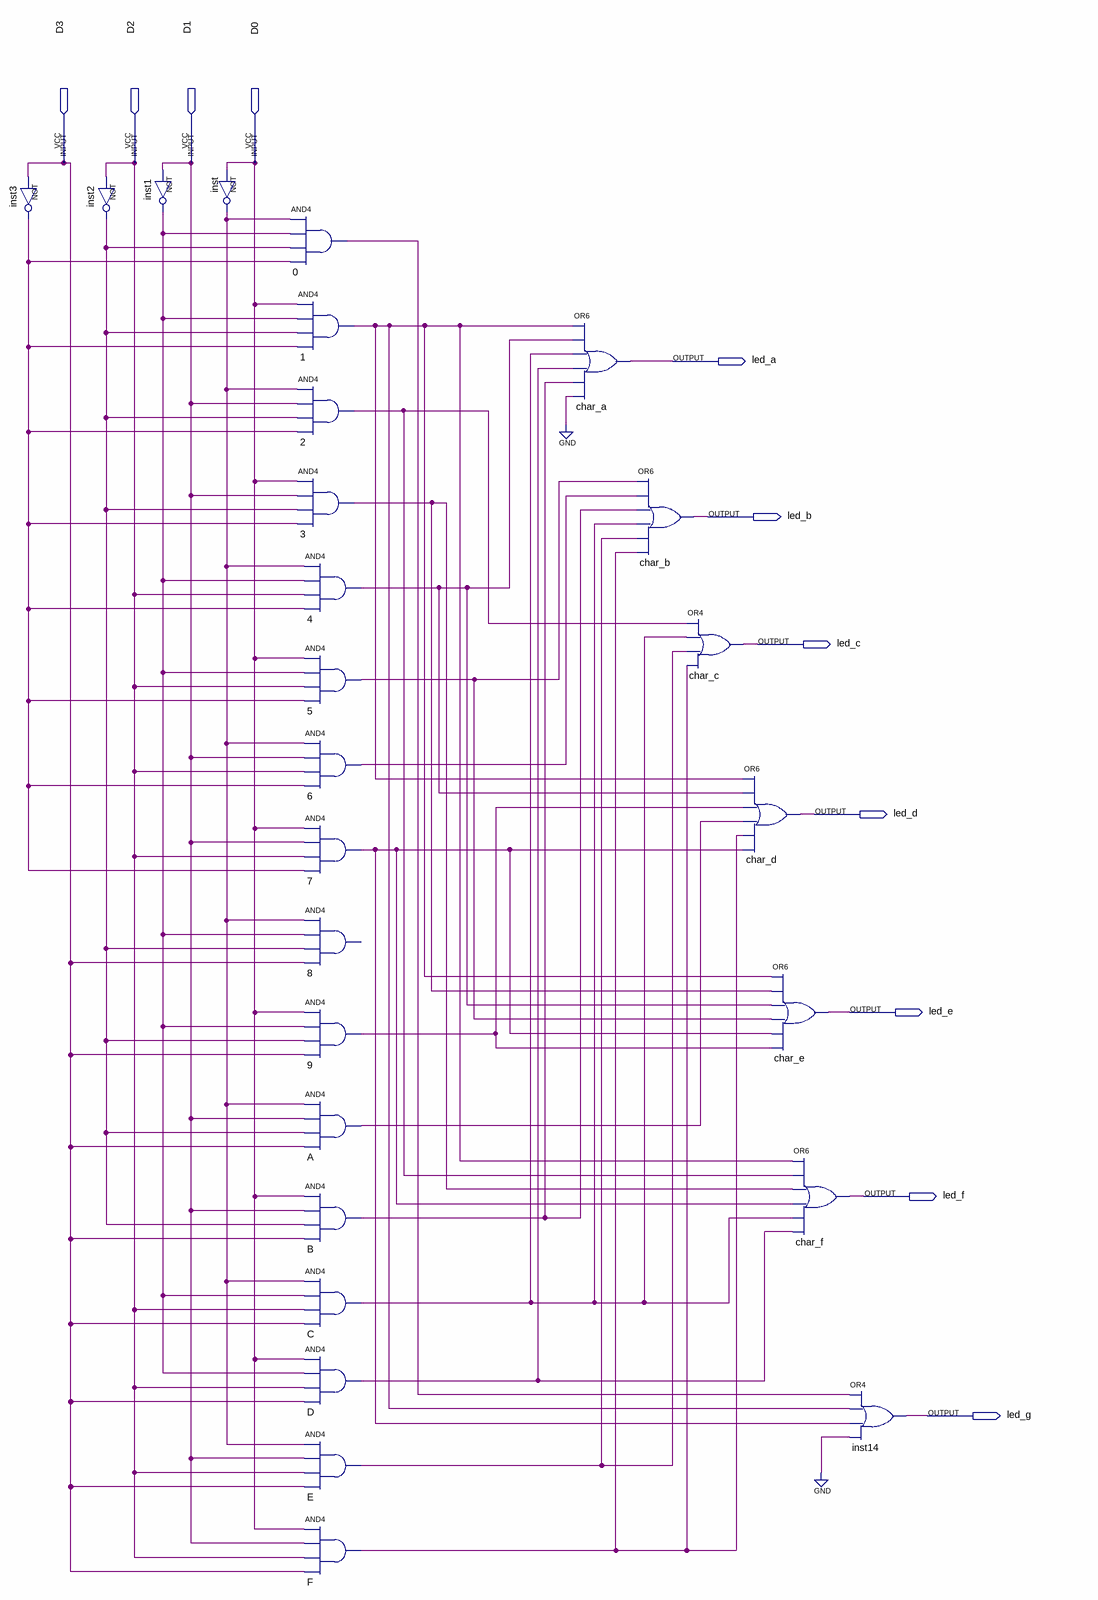
[diagram p0: schematic sheet]
// Quartus schematic display.bdf as structural Verilog: 27 symbols, 11 pins
module display (
  input  D3,
  input  D2,
  input  D1,
  input  D0,
  output led_a,
  output led_b,
  output led_c,
  output led_d,
  output led_e,
  output led_f,
  output led_g
);

  wire A_out, B_out, C_out, D_out, E_out, F_out, inst1_out, inst2_out, inst3_out, inst_out, n0_out, n1_out,
       n2_out, n3_out, n4_out, n5_out, n6_out, n7_out, n9_out;

  not inst3 (inst3_out, D3);
  not inst2 (inst2_out, D2);
  not inst1 (inst1_out, D1);
  not inst (inst_out, D0);
  and u_0 (n0_out, inst_out, inst1_out, inst2_out, inst3_out);
  and u_1 (n1_out, D0, inst1_out, inst2_out, inst3_out);
  and u_2 (n2_out, inst_out, D1, inst2_out, inst3_out);
  and u_3 (n3_out, D0, D1, inst2_out, inst3_out);
  and u_4 (n4_out, inst_out, inst1_out, D2, inst3_out);
  and u_5 (n5_out, D0, inst1_out, D2, inst3_out);
  and u_6 (n6_out, inst_out, D1, D2, inst3_out);
  and u_7 (n7_out, D0, D1, D2, inst3_out);
  // AND4 8 has open pins: IN1=inst_out, IN2=inst1_out, IN3=inst2_out, IN4=D3, OUT=open
  and u_9 (n9_out, D0, inst1_out, inst2_out, D3);
  and A (A_out, inst_out, D1, inst2_out, D3);
  and B (B_out, D0, D1, inst2_out, D3);
  and C (C_out, inst_out, inst1_out, D2, D3);
  and D (D_out, D0, inst1_out, D2, D3);
  and E (E_out, inst_out, D1, D2, D3);
  and F (F_out, D0, D1, D2, D3);
  or char_a (led_a, n1_out, n4_out, C_out, D_out, B_out, 1'b0);
  or char_b (led_b, n5_out, n6_out, B_out, C_out, E_out, F_out);
  or char_c (led_c, n2_out, C_out, E_out, F_out);
  or char_d (led_d, n1_out, n4_out, n9_out, A_out, F_out, n7_out);
  or char_e (led_e, n1_out, n3_out, n4_out, n5_out, n7_out, n9_out);
  or char_f (led_f, n1_out, n2_out, n3_out, n7_out, C_out, D_out);
  or inst14 (led_g, n0_out, n1_out, n7_out, 1'b0);
endmodule
